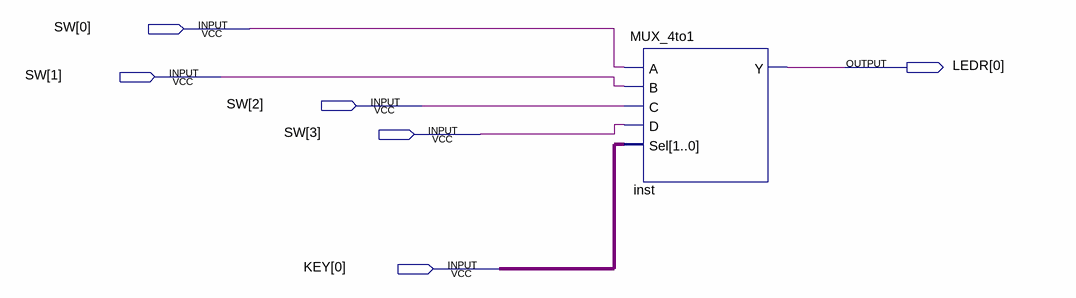
[diagram p0: schematic sheet]
// Quartus schematic Mux4_1Demo.bdf as structural Verilog: 1 symbols, 6 pins
module Mux4_1Demo (
  input  [3:0] SW,
  input  [0:0] KEY,
  output [0:0] LEDR
);

  wire [1:0] undriven;

  MUX_4to1 inst (.A(SW[0]), .B(SW[1]), .C(SW[2]), .D(SW[3]), .Sel(undriven), .Y(LEDR[0]));
endmodule
